# EAGLE design BaseCutout (EAGLE 7.3.0)
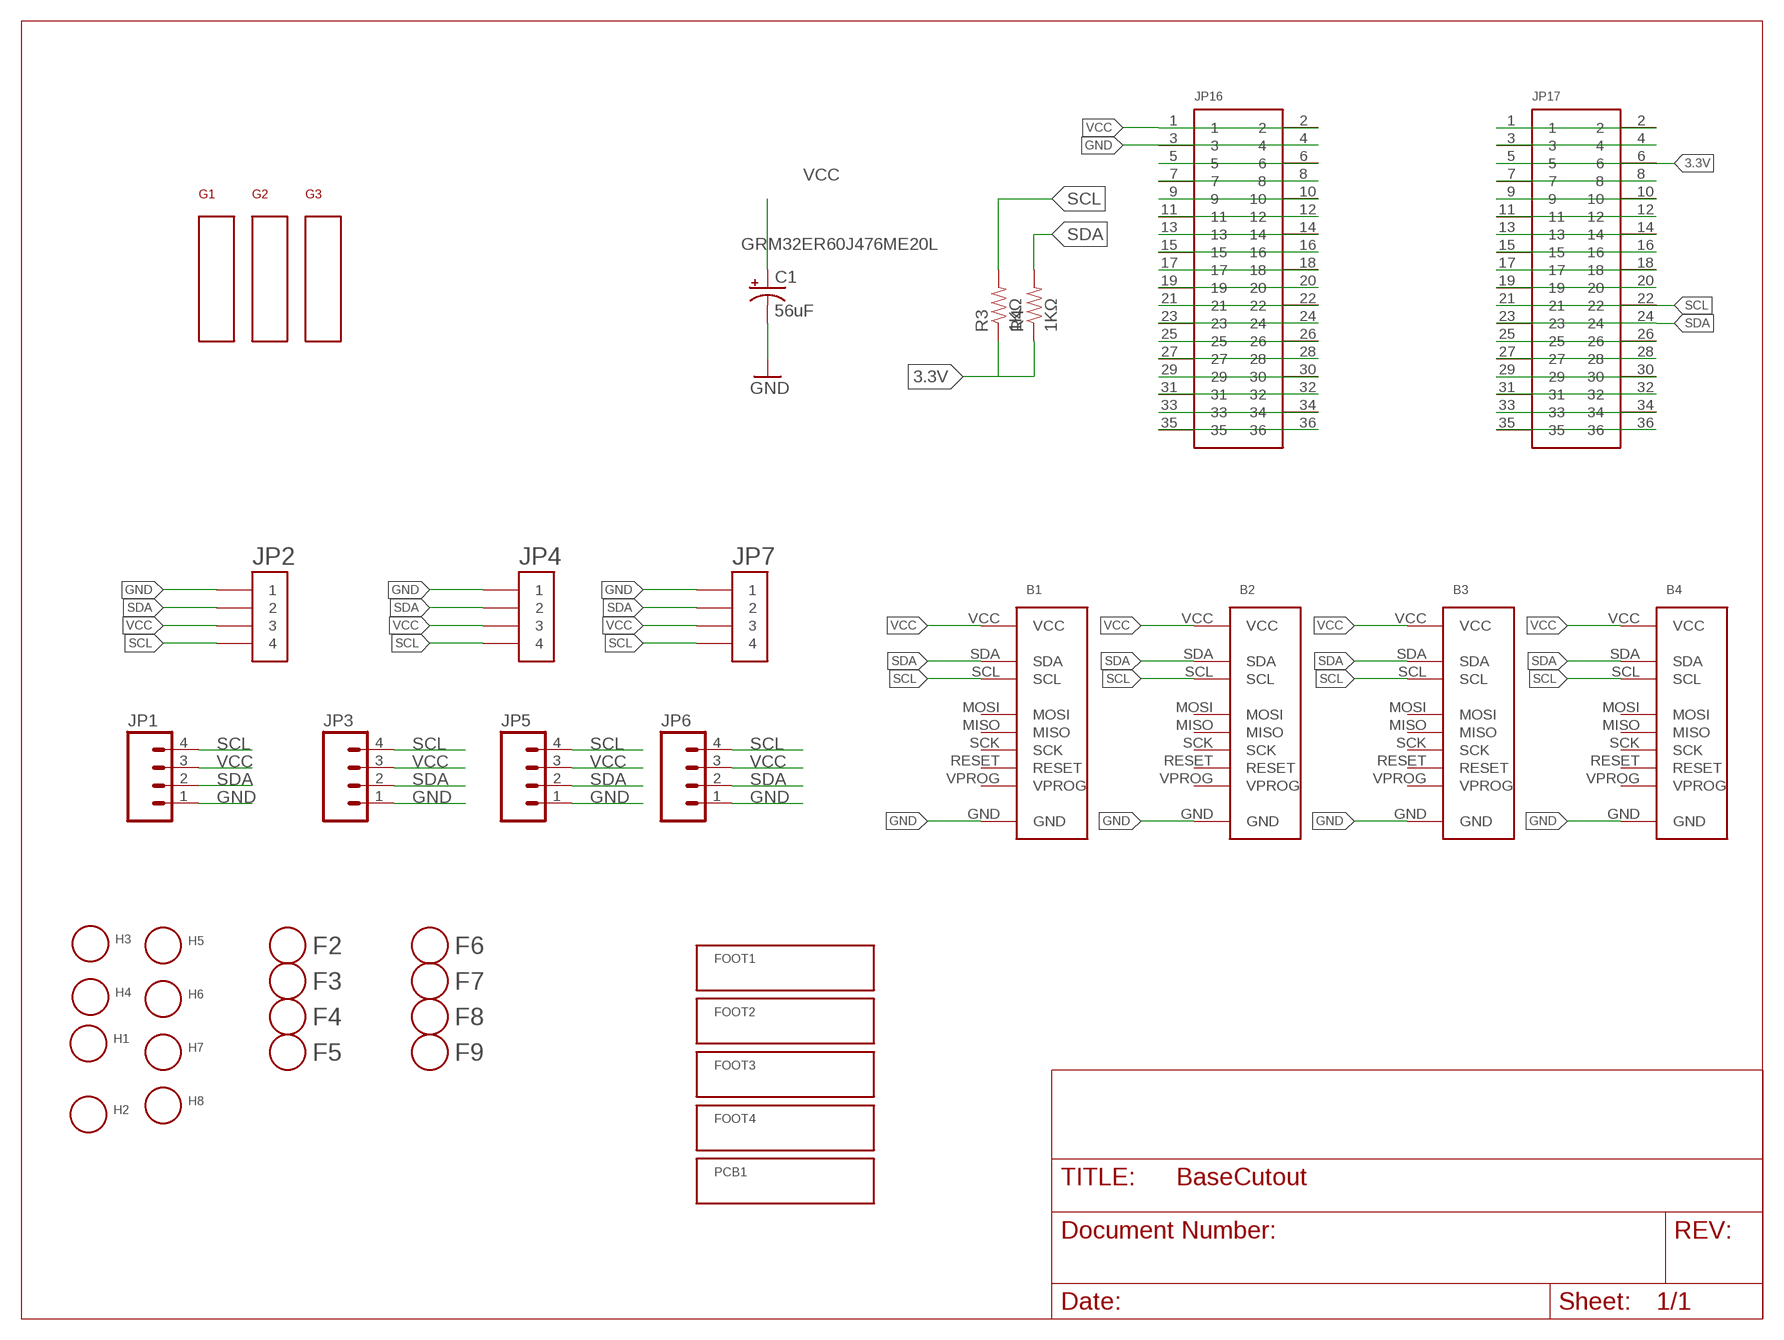
[diagram p0: schematic, sheet 1]
FOOT1 (BOM_ITEM): PARTNUM: SJ5382
FOOT2 (BOM_ITEM): PARTNUM: SJ5382
FOOT3 (BOM_ITEM): PARTNUM: SJ5382
FOOT4 (BOM_ITEM): PARTNUM: SJ5382
FRAME1 (LETTER_L): BOM: EXCLUDE
PCB1 (BOM_ITEM): DESCRIPTION: PCB; PARTNUM: Base PCB

## Parts
B1  BASE-PADS  [BASE-PADS]
B2  BASE-PADS  [BASE-PADS]
B3  BASE-PADS  [BASE-PADS]
B4  BASE-PADS  [BASE-PADS]
C1  56uF  CAPACITOR-POL-56UF-25V  [PANASONIC_D]
F2  FIDUCIAL  [FIDUCIAL_1MM]
F3  FIDUCIAL  [FIDUCIAL_1MM]
F4  FIDUCIAL  [FIDUCIAL_1MM]
F5  FIDUCIAL  [FIDUCIAL_1MM]
F6  FIDUCIAL  [FIDUCIAL_1MM]
F7  FIDUCIAL  [FIDUCIAL_1MM]
F8  FIDUCIAL  [FIDUCIAL_1MM]
F9  FIDUCIAL  [FIDUCIAL_1MM]
G1  CARD-GUIDE  [CARD-GUIDE-2"]
G2  CARD-GUIDE  [CARD-GUIDE-2"]
G3  CARD-GUIDE  [CARD-GUIDE-2"]
H1  HOLE#2  [HOLE-#2]
H2  HOLE#2  [HOLE-#2]
H3  HOLE#2  [HOLE-#2]
H4  HOLE#2  [HOLE-#2]
H5  HOLE#2  [HOLE-#2]
H6  HOLE#2  [HOLE-#2]
H7  HOLE#2  [HOLE-#2]
H8  HOLE#2  [HOLE-#2]
JP1  M04LOCK  [1X04_LOCK]
JP2  HEADER-1X4-JST-PA-TOP-SMD  [JST-PA-TOP-SMD]
JP3  M04LOCK  [1X04_LOCK]
JP4  HEADER-1X4-JST-PA-TOP-SMD  [JST-PA-TOP-SMD]
JP5  M04LOCK  [1X04_LOCK]
JP6  M04LOCK  [1X04_LOCK]
JP7  HEADER-1X4-JST-PA-TOP-SMD  [JST-PA-TOP-SMD]
JP16  HEADER-2X18  [2X18-LOCK]
JP17  HEADER-2X18  [2X18-LOCK]
R3  1KΩ  RESISTOR-1KΩ  [0603]
R4  1KΩ  RESISTOR-1KΩ  [0603]

## Nets
3.3V: JP17.5 JP17.6 R3.1 R4.1
GND: B1.GND B2.GND B3.GND B4.GND C1.- JP1.1 JP2.1 JP3.1 JP4.1 JP5.1 JP6.1 JP7.1 JP16.3 JP16.4
N$1: JP16.5 JP16.6
N$2: JP16.7 JP16.8
N$3: JP16.9 JP16.10
N$4: JP16.11 JP16.12
N$5: JP16.13 JP16.14
N$6: JP16.15 JP16.16
N$7: JP16.17 JP16.18
N$8: JP16.19 JP16.20
N$9: JP16.21 JP16.22
N$10: JP16.23 JP16.24
N$11: JP16.25 JP16.26
N$12: JP16.27 JP16.28
N$13: JP16.29 JP16.30
N$15: JP16.31 JP16.32
N$17: JP16.33 JP16.34
N$18: JP16.35 JP16.36
N$19: JP17.1 JP17.2
N$20: JP17.3 JP17.4
N$21: JP17.7 JP17.8
N$22: JP17.9 JP17.10
N$23: JP17.11 JP17.12
N$24: JP17.13 JP17.14
N$25: JP17.15 JP17.16
N$26: JP17.17 JP17.18
N$27: JP17.19 JP17.20
N$28: JP17.25 JP17.26
N$29: JP17.27 JP17.28
N$30: JP17.29 JP17.30
N$31: JP17.31 JP17.32
N$32: JP17.33 JP17.34
N$33: JP17.35 JP17.36
SCL: B1.SCL B2.SCL B3.SCL B4.SCL JP1.4 JP2.4 JP3.4 JP4.4 JP5.4 JP6.4 JP7.4 JP17.21 JP17.22 R3.2
SDA: B1.SDA B2.SDA B3.SDA B4.SDA JP1.2 JP2.2 JP3.2 JP4.2 JP5.2 JP6.2 JP7.2 JP17.23 JP17.24 R4.2
VCC: B1.VCC B2.VCC B3.VCC B4.VCC C1.+ JP1.3 JP2.3 JP3.3 JP4.3 JP5.3 JP6.3 JP7.3 JP16.1 JP16.2
Unconnected: B1.MISO B1.MOSI B1.RESET B1.SCK B1.VPROG B2.MISO B2.MOSI B2.RESET B2.SCK B2.VPROG B3.MISO B3.MOSI B3.RESET B3.SCK B3.VPROG B4.MISO B4.MOSI B4.RESET B4.SCK B4.VPROG H1.P$1(HOLE) H2.P$1(HOLE) H3.P$1(HOLE) H4.P$1(HOLE) H5.P$1(HOLE) H6.P$1(HOLE) H7.P$1(HOLE) H8.P$1(HOLE)

## Notes on the sheet
- GRM32ER60J476ME20L

## Library data of the parts
B1-B4 = Modulo:BASE-PADS; BOM: EXCLUDE
C1 = Modulo:CAPACITOR-POL; PARTNUM: EMVA250ADA560MF55G
F2-F9 = Modulo:FIDUCIAL; BOM: EXCLUDE
G1 G3 = Modulo:CARD-GUIDE; PARTNUM: HCG-201-165
G2 = Modulo:CARD-GUIDE; PARTNUM: HCG-202-165
H1-H4 = Modulo:HOLE; NOBOM: 1; PARTNUM: EXCLUDE
H5-H8 = Modulo:HOLE; PARTNUM: EXCLUDE
JP1 JP3 JP5 JP6 = SparkFun-Connectors:M04: Header 4 Standard 4-pin 0.1" header. Use with straight break away headers (SKU : PRT-00116), right angle break away headers (PRT-00553), swiss pins (PRT-00743), machine pins (PRT-00117), and female headers (PRT-00115). Molex polarized connector foot print use with SKU : PRT-08231 with associated crimp pins and housings. 1MM SMD Version SKU: PRT-10208; PARTNUM: M20-9750446
JP2 JP4 JP7 = Modulo:HEADER-1X4; PARTNUM: SM04B-PASS-TBT(LF)(SN)
JP16 JP17 = Modulo:HEADER-2X18; PARTNUM: PPTC182LFBN-RC
R3 R4 = Modulo:RESISTOR: Resistor Basic schematic elements and footprints for 0603, 1206, and PTH resistors.; PARTNUM: ERJ-3EKF1001V

## Board
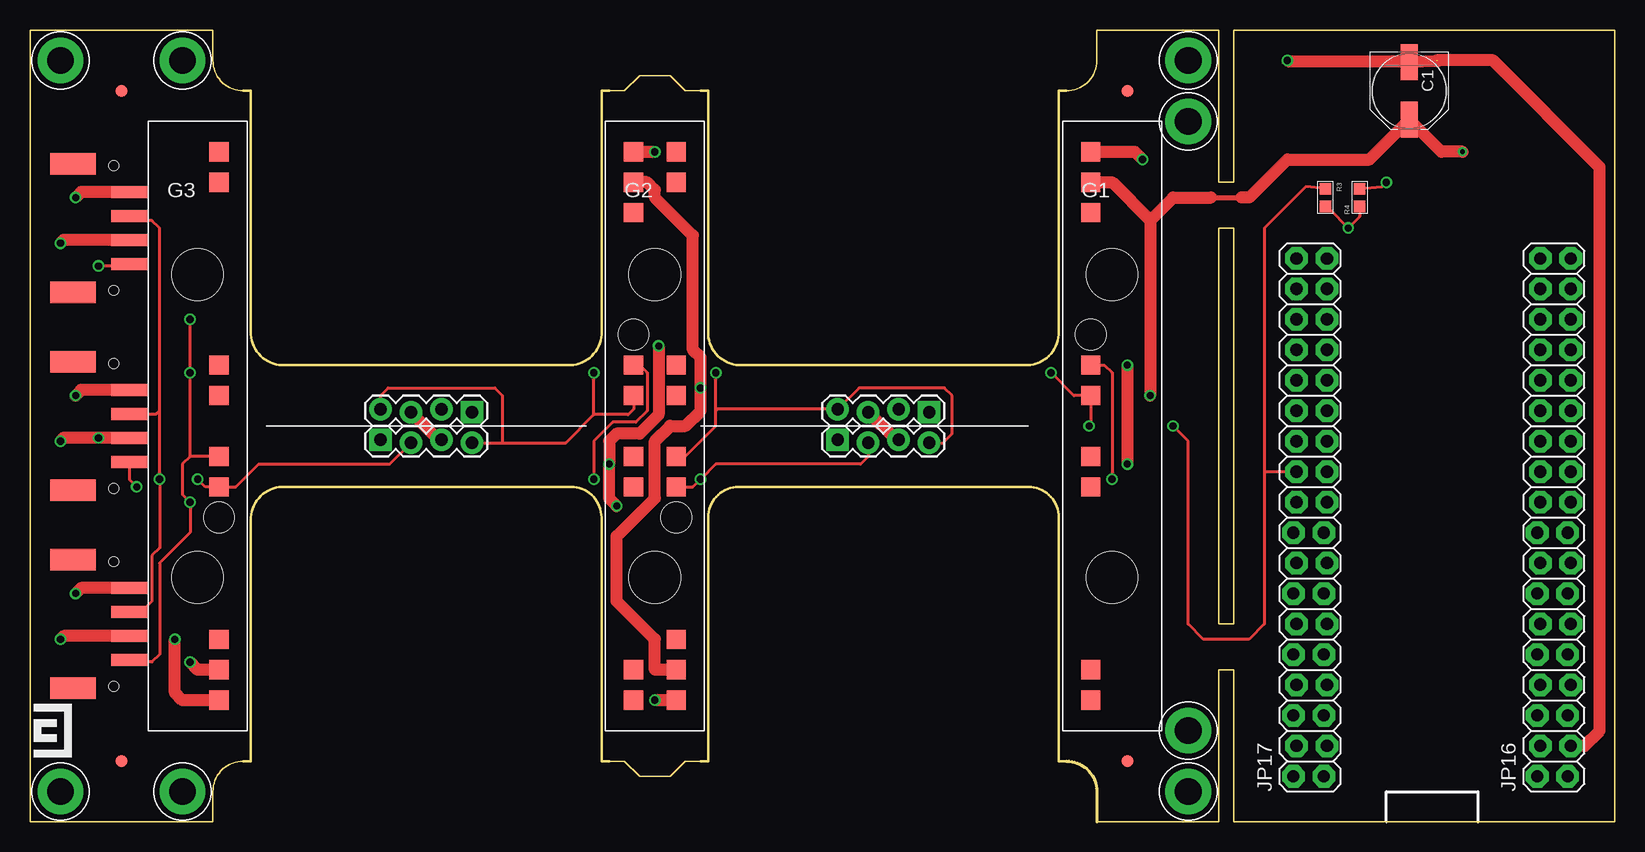
[diagram p1: board, top side]
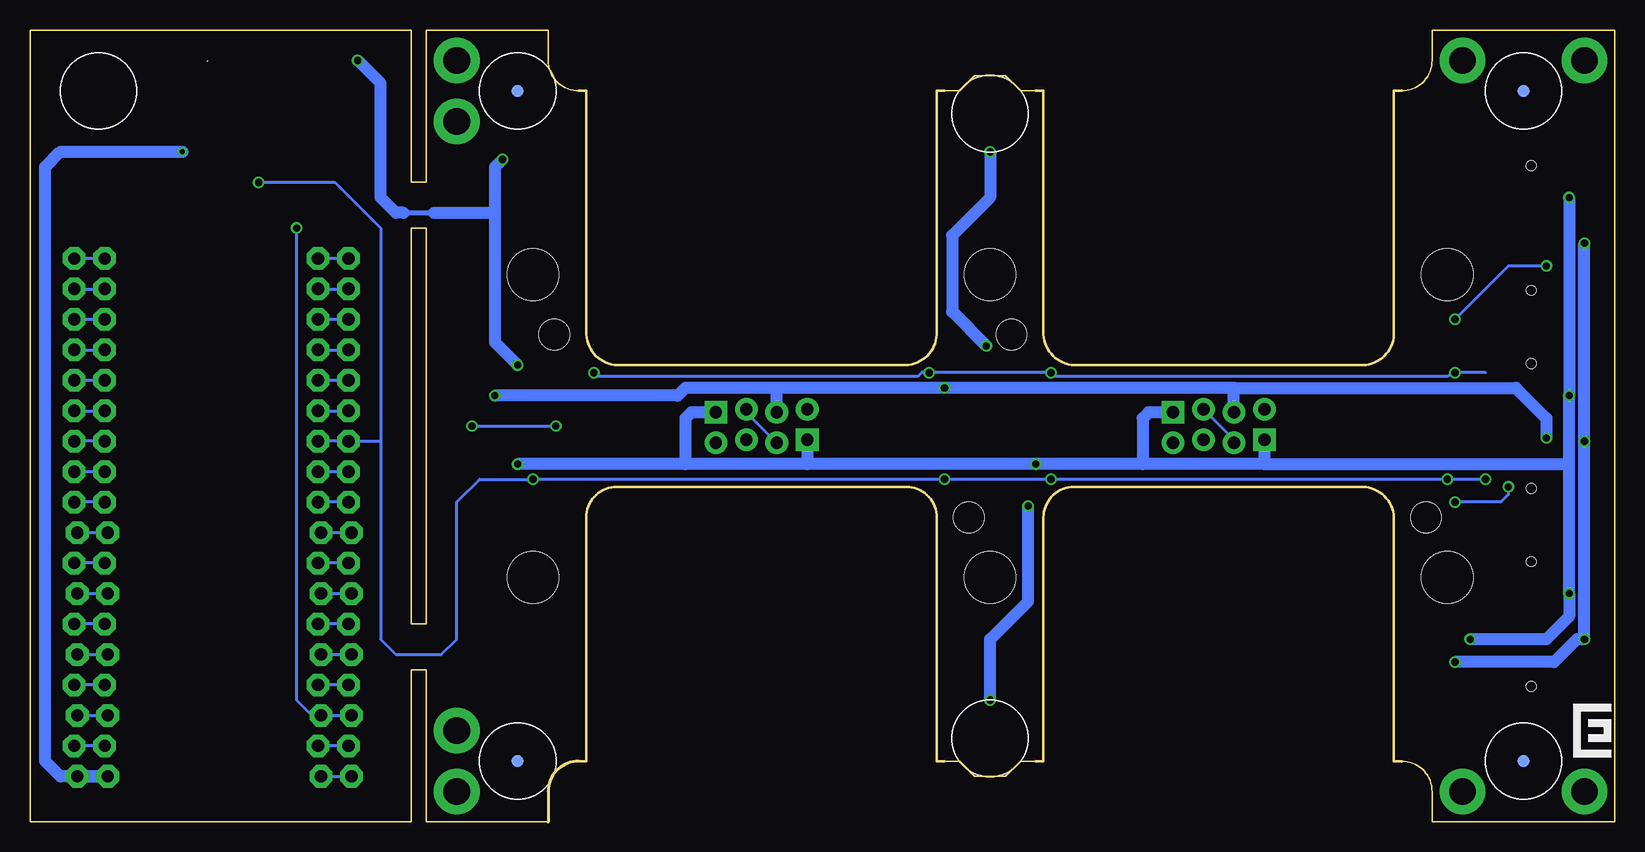
[diagram p2: board, bottom side, seen from below]

Size 132.08 x 66.04 mm. Coordinates in mm from the lower left corner, seen from the top.
Outline: 0,0 0,66.04 15.24,66.04 15.24,63.5 arc90 17.78,60.96 18.41,60.96 18.41,40.64 arc90 21.27,38.1 44.77,38.1 arc90 47.62,40.64 47.62,60.96 48.26,60.96 49.53,60.96 50.8,62.23 53.34,62.23 54.61,60.96 55.88,60.96 56.52,60.96 56.52,40.64 arc90 59.37,38.1 82.87,38.1 arc90 85.72,40.64 85.72,60.96 86.36,60.96 arc90 88.9,63.5 88.9,66.04 99.06,66.04 99.06,53.34 100.33,53.34 100.33,66.04 132.08,66.04 132.08,0 100.33,0 100.33,12.7 99.06,12.7 99.06,0 88.9,0 88.9,2.54 arc90 86.36,5.08 85.72,5.08 85.72,25.4 arc90 83.19,27.94 59.05,27.94 arc90 56.52,25.4 56.52,5.08 55.88,5.08 54.61,5.08 53.34,3.81 50.8,3.81 49.53,5.08 48.26,5.08 47.62,5.08 47.62,25.4 arc90 45.09,27.94 21.27,27.94 arc90 18.41,25.4 18.41,5.08 17.78,5.08 arc90 15.24,2.54 15.24,0 0,0
Outline: 99.06,16.51 99.06,49.53 100.33,49.53 100.33,16.51 99.06,16.51
Copper layers (1*16): Top 0.0356mm / dielectric 1.5011mm / Bottom 0.0356mm
Design rules "LaenPCBOrder": minimum track width 6mil, minimum drill 13mil, track to track 6mil, track to pad 6mil, pad to pad 6mil, via to via 6mil, smd to smd 6mil, copper to edge 15mil, drill to drill 6mil, minimum pad ring 7mil, minimum via ring 7mil, stop-mask expansion 3mil, vias tented up to drill 0mil, thermal gap 10mil

### Footprints (pad centres in the part's own frame; a part is rotated, then mirrored left to right if it is on the bottom)
BASE-PADS = smd 1.6 x 1.6: GND 1.778,-22.86; MISO 1.778,5.08; MOSI 1.778,22.86; RESET 1.778,20.32; SCK 1.778,2.54; SCL 1.778,-2.54; SDA 1.778,-5.08; VCC 1.778,-20.32; VPROG 1.778,-17.78 | hole 2.54: 1.778,-7.62
PANASONIC_D = smd 3 x 1.4: + 2.4,0; - -2.4,0
FIDUCIAL_1MM = smd 1 x 1: 1 0,0
CARD-GUIDE-2" = hole 4.293: 0,-12.624; 0,12.624
HOLE-#2 = drill 2.223 pad 3.81: P$1 0,0
1X04_LOCK = drill 1.016 pad 1.88 square: 1 0,0.127 | drill 1.016 pad 1.88: 2 2.54,-0.127; 3 5.08,0.127; 4 7.62,-0.127
JST-PA-TOP-SMD = smd 1 x 3: 1 -3,1.3; 2 -1,1.3; 3 1,1.3; 4 3,1.3 | smd 1.8 x 3.8: R1 -5.35,-3.4; R2 5.35,-3.4 | hole 0.8: 5.2,0; -5.2,0
2X18-LOCK = drill 1.016 pad 1.88 octagon: 1 -21.59,-1.143; 2 -21.59,1.397; 3 -19.05,-1.397; 4 -19.05,1.143; 5 -16.51,-1.143; 6 -16.51,1.397; 7 -13.97,-1.397; 8 -13.97,1.143; 9 -11.43,-1.143; 10 -11.43,1.397; 11 -8.89,-1.397; 12 -8.89,1.143; 13 -6.35,-1.143; 14 -6.35,1.397; 15 -3.81,-1.397; 16 -3.81,1.143; 17 -1.27,-1.143; 18 -1.27,1.397; 19 1.27,-1.397; 20 1.27,1.143; 21 3.81,-1.397; 22 3.81,1.143; 23 6.35,-1.397; 24 6.35,1.143; 25 8.89,-1.397; 26 8.89,1.143; 27 11.43,-1.397; 28 11.43,1.143; 29 13.97,-1.397; 30 13.97,1.143; 31 16.51,-1.397; 32 16.51,1.143; 33 19.05,-1.397; 34 19.05,1.143; 35 21.59,-1.397; 36 21.59,1.143
0603 = smd 0.95 x 0.95: 1 -0.725,0; 2 0.725,0

### Placement (x,y rotation side)
B1  52.07,33.02 180 top
B2  90.17,33.02 180 top
B3  52.07,33.02 0 top
B4  13.97,33.02 0 top
C1  114.94,60.96 270 top
F2  7.62,60.96 0 top
F3  7.62,5.08 0 top
F4  91.44,5.08 0 top
F5  91.44,60.96 0 top
F6  7.62,60.96 0 bottom
F7  7.62,5.08 90 bottom
F8  91.44,60.96 90 bottom
F9  91.44,5.08 0 bottom
G1  90.17,33.02 0 top
G2  52.07,33.02 0 top
G3  13.97,33.02 0 top
H1  96.52,58.42 0 top
H2  96.52,2.54 0 top
H3  2.54,2.54 0 top
H4  2.54,63.5 0 top
H5  12.7,2.54 0 top
H6  12.7,63.5 0 top
H7  96.52,63.5 0 top
H8  96.52,7.62 0 top
JP1  29.21,31.75 0 top
JP2  6.99,16.51 270 top
JP3  36.83,34.29 180 top
JP4  6.99,49.53 270 top
JP5  67.31,31.75 0 top
JP6  74.93,34.29 180 top
JP7  6.99,33.02 270 top
JP16  127,25.4 90 top
JP17  106.68,25.4 90 top
R3  107.95,52.07 90 top
R4  110.81,52.07 90 top
U$2  [LOGO-SMALL]  0.95,7.94 270 top
U$10  [LOGO-SMALL]  0.95,7.3 90 bottom

### Tracks (layer width: path | path; a pad name or v marks a point on that pad's centre or on a via)
3.3V  (via drill 0.6)
  Top 0.254: R4.1 110.81,50.48 v109.86,49.53 108.22,51.17 R3.1
  Bottom 0.254: v109.86,49.53 109.86,10.16 108.58,8.89 JP17.5 JP17.6
GND  (via drill 0.6)  (1 unrouted)
  Top 0.254: 129.54,6.35 JP16.3
  Top 1.016: B2.GND 92.08,55.88 v92.71,55.24 | v91.44,38.1 v91.44,29.84 | B3.GND v52.07,10.16 | v48.9,26.35 48.26,26.99 v48.26,29.84 48.26,31.75 48.9,32.38 50.8,32.38 52.39,33.97 v52.39,39.69 | B1.GND v52.07,55.88 | JP4.1 4.27,52.53 v3.81,52.07 | JP7.1 4.27,36.02 v3.81,35.56 | JP2.1 4.27,19.51 v3.81,19.05 | B4.GND 12.7,10.16 12.06,10.79 v12.06,15.24 | v104.78,63.5 104.83,63.45 114.85,63.45 C1.- 117.33,63.45 | 129.54,6.35 130.81,7.62 130.81,54.61 121.92,63.5 117.21,63.5
  Bottom 0.254: JP16.4 JP16.3
  Bottom 0.406: 100.97,50.8 98.42,50.8
  Bottom 1.016: JP1.1 29.21,29.84 | 29.21,29.84 39.37,29.84 | 39.37,29.84 v48.26,29.84 67.31,29.84 | 67.31,29.84 77.47,29.84 | 77.47,29.84 v91.44,29.84 | JP3.1 38.86,34.16 39.37,33.66 39.37,29.84 | JP5.1 67.31,29.84 | JP6.1 76.96,34.16 77.47,33.66 77.47,29.84 | 29.21,29.84 3.81,29.84 | v92.71,55.24 93.34,54.61 93.34,50.8 | 93.34,50.8 93.34,40.01 v91.44,38.1 | v52.07,10.16 52.07,15.24 48.9,18.41 v48.9,26.35 | v52.07,55.88 52.07,52.07 55.24,48.9 55.24,42.55 v52.39,39.69 | 3.81,29.84 v3.81,19.05 3.81,17.14 5.71,15.24 v12.06,15.24 | 3.81,29.84 v3.81,35.56 v3.81,52.07 | 100.97,50.8 101.6,50.8 102.87,52.07 102.87,61.59 v104.78,63.5 | 98.42,50.8 93.34,50.8
N$1
  Bottom 0.254: JP16.5 JP16.6
N$2
  Bottom 0.254: JP16.8 JP16.7
N$3
  Bottom 0.254: JP16.9 JP16.10
N$4
  Bottom 0.254: JP16.12 JP16.11
N$5
  Bottom 0.254: JP16.13 JP16.14
N$6
  Bottom 0.254: JP16.16 JP16.15
N$7
  Bottom 0.254: JP16.17 JP16.18
N$8
  Bottom 0.254: JP16.20 JP16.19
N$9
  Bottom 0.254: JP16.21 JP16.22
N$10
  Bottom 0.254: JP16.24 JP16.23
N$11
  Bottom 0.254: JP16.25 JP16.26
N$12
  Bottom 0.254: JP16.28 JP16.27
N$13
  Bottom 0.254: JP16.29 JP16.30
N$15
  Bottom 0.254: JP16.32 JP16.31
N$17
  Bottom 0.254: JP16.33 JP16.34
N$18
  Bottom 0.254: JP16.36 JP16.35
N$19
  Bottom 0.254: JP17.1 JP17.2
N$20
  Bottom 0.254: JP17.4 JP17.3
N$21
  Bottom 0.254: JP17.8 JP17.7
N$22
  Bottom 0.254: JP17.9 JP17.10
N$23
  Bottom 0.254: JP17.12 JP17.11
N$24
  Bottom 0.254: JP17.13 JP17.14
N$25
  Bottom 0.254: JP17.16 JP17.15
N$26
  Bottom 0.254: JP17.17 JP17.18
N$27
  Bottom 0.254: JP17.20 JP17.19
N$28
  Bottom 0.254: JP17.25 JP17.26
N$29
  Bottom 0.254: JP17.28 JP17.27
N$30
  Bottom 0.254: JP17.29 JP17.30
N$31
  Bottom 0.254: JP17.32 JP17.31
N$32
  Bottom 0.254: JP17.33 JP17.34
N$33
  Bottom 0.254: JP17.36 JP17.35
SCL  (via drill 0.6)
  Top 0.254: v85.09,37.47 87,35.56 B2.SCL 88.39,33.15 v88.27,33.02 | B3.SCL 54.61,30.48 57.15,33.02 57.15,34.29 | 57.15,34.29 v57.15,37.47 | B1.SCL 50.29,34.42 49.85,33.97 46.99,33.97 | 46.99,33.97 v46.99,37.47 | B4.SCL 13.34,30.48 | 13.34,30.48 v13.34,37.47 v13.34,41.91 | JP2.4 8.46,13.34 10.16,13.34 10.79,13.97 10.79,21.59 13.34,24.13 v13.34,26.67 12.7,27.3 12.7,29.84 13.34,30.48 | JP4.4 8.46,46.35 v5.71,46.35 | JP7.4 8.29,28.55 v8.89,27.94 | 57.15,34.29 57.28,34.42 JP6.4 69.09,36.2 76.2,36.2 76.83,35.56 76.83,32.38 76.07,31.62 JP5.4 | JP1.4 39.37,31.62 | 39.37,31.62 44.64,31.62 46.99,33.97 | JP3.4 29.21,35.56 29.84,36.2 38.73,36.2 39.37,35.56 39.37,31.62 | 102.87,29.21 102.87,16.51 101.6,15.24 97.79,15.24 96.52,16.51 96.52,31.75 v95.25,33.02 | R3.2 106.31,52.97 102.87,49.53 102.87,29.21 | 102.87,29.21 JP17.22
  Bottom 0.254: 10.79,37.47 v13.34,37.47 13.97,37.15 46.67,37.15 v46.99,37.47 v57.15,37.47 57.78,37.47 58.1,37.15 84.77,37.15 v85.09,37.47 | v5.71,46.35 8.89,46.35 v13.34,41.91 | v8.89,27.94 8.89,27.3 9.53,26.67 v13.34,26.67 | v95.25,33.02 v88.27,33.02 | JP17.21 JP17.22
SDA  (via drill 0.6)
  Top 0.254: B2.SDA 89.53,38.1 90.17,37.47 v90.17,28.57 | B3.SDA 55.24,27.94 v55.88,28.57 57.15,29.84 69.22,29.84 69.85,30.48 JP5.2 | v46.99,28.57 46.99,31.75 48.58,33.34 50.48,33.34 51.44,34.29 51.44,37.47 50.8,38.1 B1.SDA | 10.79,34.29 v10.79,28.57 10.79,22.86 10.16,22.23 10.16,18.41 9.53,17.78 8.55,17.78 JP2.2 | 10.79,34.29 10.79,49.53 10.16,50.16 8.65,50.16 JP4.2 | JP7.2 10.53,34.02 10.79,34.29 | JP1.2 29.97,29.84 19.05,29.84 17.14,27.94 B4.SDA 14.61,27.94 v13.97,28.57 | R4.2 112.66,52.97 v113.03,53.34
  Bottom 0.254: v10.79,28.57 v13.97,28.57 v46.99,28.57 v55.88,28.57 v90.17,28.57 94.61,28.57 96.52,26.67 96.52,15.24 97.79,13.97 101.6,13.97 102.87,15.24 102.87,31.75 | JP1.2 31.75,31.88 JP3.2 | JP6.2 72.39,34.16 JP5.2 | 102.87,31.75 JP17.24 JP17.23 | v113.03,53.34 106.68,53.34 102.87,49.53 102.87,31.75
VCC  (via drill 0.41, 0.6)
  Top 0.406: 98.42,52.07 100.97,52.07
  Top 1.016: JP1.3 34.04,31.88 JP3.3 | JP5.3 72.14,31.88 JP6.3 | B2.VCC 90.17,53.34 93.34,50.16 | 93.34,50.16 v93.34,35.56 | 53.98,12.7 B3.VCC 52.07,12.7 52.07,15.24 48.9,18.41 48.9,23.81 52.07,26.99 52.07,31.75 53.34,33.02 54.61,33.02 55.88,34.29 v55.88,36.2 55.88,38.73 55.24,39.37 55.24,48.9 52.07,52.07 52.07,52.7 51.44,53.34 B1.VCC | JP4.3 2.81,48.53 v2.54,48.26 | JP7.3 v5.71,32.02 2.81,32.02 v2.54,31.75 | JP2.3 2.81,15.51 v2.54,15.24 | B4.VCC 13.97,12.7 v13.34,13.34 | 93.34,50.16 95.25,52.07 98.42,52.07 | 100.97,52.07 101.6,52.07 104.78,55.24 111.62,55.24 C1.+ 117.61,55.88 v119.38,55.88
  Bottom 1.016: JP3.3 31.75,36.2 | 31.75,36.2 v55.88,36.2 69.85,36.2 | 69.85,36.2 77.47,36.2 78.11,35.56 v93.34,35.56 | JP6.3 69.85,36.2 | 31.75,36.2 8.26,36.2 5.71,33.66 v5.71,32.02 | v2.54,48.26 v2.54,31.75 v2.54,15.24 3.17,15.24 5.08,13.34 v13.34,13.34 | JP16.1 JP16.2 129.54,3.81 130.81,5.08 130.81,54.61 129.54,55.88 v119.38,55.88